# Altium schematic sheet Mainboard_RMII_Interface.SchDoc
size A4
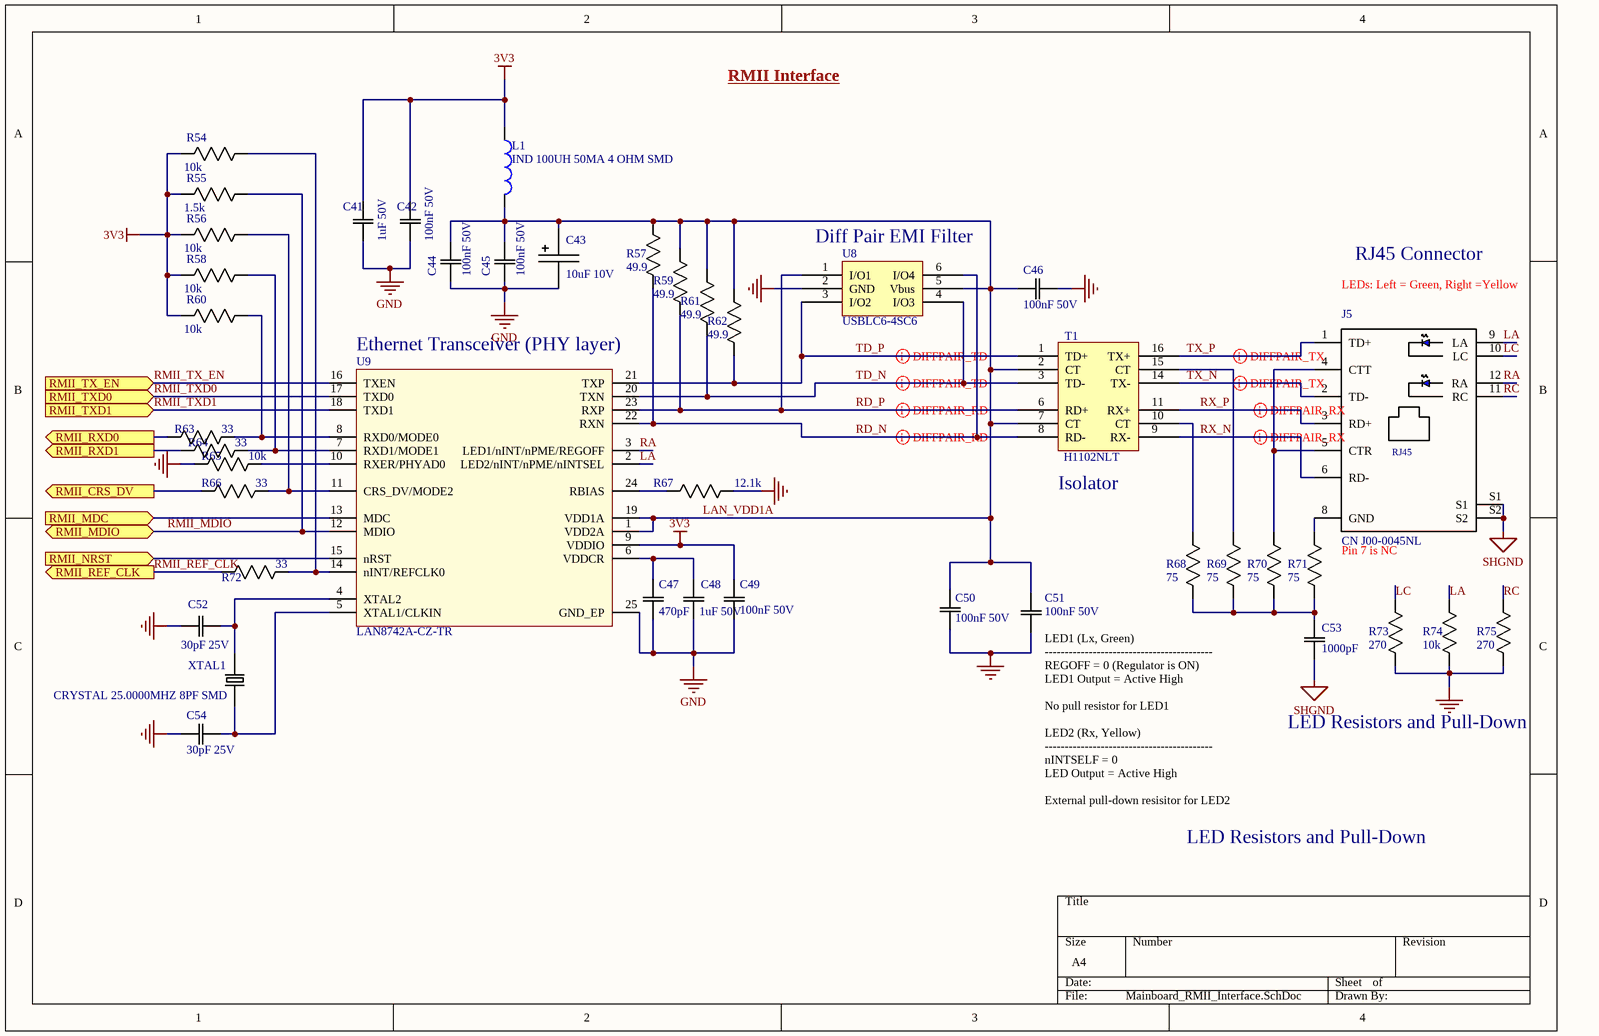
[diagram p0: Mainboard_RMII_Interface.SchDoc]

## Parts
C41  1uF 50V  [0805]
C42  100nF 50V  [0805]
C43  10uF 10V  [1206 Polarized]
C44  100nF 50V  [0805]
C45  100nF 50V  [0805]
C46  100nF 50V  [0805]
C47  470pF  [0805]
C48  1uF 50V  [0805]
C49  100nF 50V  [0805]
C50  100nF 50V  [0805]
C51  100nF 50V  [0805]
C52  30pF 25V  [0805]
C53  1000pF  [0805]
C54  30pF 25V  [0805]
J5  CN J00-0045NL  [RJ45 J00-0045NL]
L1  IND 100UH 50MA 4 OHM SMD  [0805]
R54  10k  [0805]
R55  1.5k  [0805]
R56  10k  [0805]
R57  49.9  [0805]
R58  10k  [0805]
R59  49.9  [0805]
R60  10k  [0805]
R61  49.9  [0805]
R62  49.9  [0805]
R63  33  [0805]
R64  33  [0805]
R65  10k  [0805]
R66  33  [0805]
R67  12.1k  [0805]
R68  75  [0805]
R69  75  [0805]
R70  75  [0805]
R71  75  [0805]
R72  33  [0805]
R73  270  [0805]
R74  10k  [0805]
R75  270  [0805]
T1  H1102NLT  [TRANSFORMER]
U8  USBLC6-4SC6  [SOT23-6L]
U9  LAN8742A-CZ-TR  [24-QFN (4x4)]
XTAL1  CRYSTAL 25.0000MHZ 8PF SMD  [SMD-2]

## Ports
RMII_CRS_DV (out), RMII_MDC (in), RMII_MDIO (bidir), RMII_NRST (in), RMII_REF_CLK (out), RMII_RXD0 (out), RMII_RXD1 (out), RMII_TX_EN (in), RMII_TXD0 (in), RMII_TXD1 (in)

## Nets
3V3: C41.2(C2) C42.2(C2) C49.2(C2) L1.1 R54.2(R2) R55.2(R2) R56.2(R2) R58.2(R2) R60.2(R2) U9.9(VDDIO)
GND: C41.1(C1) C42.1(C1) C43.2(P$2) C44.1(C1) C45.1(C1) C46.2(C2) C47.1(C1) C48.1(C1) C49.1(C1) C50.1(C1) C51.1(C1) C52.1(C1) C54.1(C1) R65.2(R2) R67.1(R1) R73.2(R2) R74.2(R2) R75.2(R2) U8.2(GND) U9.25(GND_EP)
SHGND: C53.1(C1) J5.S1 J5.S2
LA: J5.9(LA) R74.1(R1) U9.2(LED2/nINT/nPME/nINTSEL)
LAN_VDD1A: C43.1(P$1) C44.2(C2) C45.2(C2) C46.1(C1) C50.2(C2) C51.2(C2) L1.2 R57.1(R1) R59.1(R1) R61.1(R1) R62.1(R1) T1.2(CT) T1.7(CT) U8.5(Vbus) U9.1(VDD2A) U9.19(VDD1A)
LC: J5.10(LC) R73.1(R1)
RA: J5.12(RA) U9.3(LED1/nINT/nPME/REGOFF)
RC: J5.11(RC) R75.1(R1)
RD_N: R57.2(R2) T1.8(RD-) U8.6(I/O4) U9.22(RXN)
RD_P: R59.2(R2) T1.6(RD+) U8.1(I/O1) U9.23(RXP)
RMII_CRS_DV: R66.2(R2) ; port RMII_CRS_DV
RMII_MDC: U9.13(MDC) ; port RMII_MDC
RMII_MDIO: R55.1(R1) U9.12(MDIO) ; port RMII_MDIO
RMII_NRST: U9.15(nRST) ; port RMII_NRST
RMII_REF_CLK: R72.2(R2) ; port RMII_REF_CLK
RMII_RXD0: R63.2(R2) ; port RMII_RXD0
RMII_RXD1: R64.2(R2) ; port RMII_RXD1
RMII_TX_EN: U9.16(TXEN) ; port RMII_TX_EN
RMII_TXD0: U9.17(TXD0) ; port RMII_TXD0
RMII_TXD1: U9.18(TXD1) ; port RMII_TXD1
RX_N: J5.6(RD-) T1.9(RX-)
RX_P: J5.3(RD+) T1.11(RX+)
TD_N: R61.2(R2) T1.3(TD-) U8.4(I/O3) U9.20(TXN)
TD_P: R62.2(R2) T1.1(TD+) U8.3(I/O2) U9.21(TXP)
TX_N: J5.2(TD-) T1.14(TX-)
TX_P: J5.1(TD+) T1.16(TX+)
NetC47_2: C47.2(C2) C48.2(C2) U9.6(VDDCR)
NetC52_2: C52.2(C2) U9.4(XTAL2) XTAL1.2
NetC53_2: C53.2(C2) R68.2(R2) R69.2(R2) R70.2(R2) R71.2(R2)
NetC54_2: C54.2(C2) U9.5(XTAL1/CLKIN) XTAL1.1
NetJ5_4: J5.4(CTT) J5.5(CTR) R70.1(R1)
NetJ5_8: J5.8(GND) R71.1(R1)
NetR54_1: R54.1(R1) R72.1(R1) U9.14(nINT/REFCLK0)
NetR56_1: R56.1(R1) R66.1(R1) U9.11(CRS_DV/MODE2)
NetR58_1: R58.1(R1) R64.1(R1) U9.7(RXD1/MODE1)
NetR60_1: R60.1(R1) R63.1(R1) U9.8(RXD0/MODE0)
NetR65_1: R65.1(R1) U9.10(RXER/PHYAD0)
NetR67_2: R67.2(R2) U9.24(RBIAS)
NetR68_1: R68.1(R1) T1.10(CT)
NetR69_1: R69.1(R1) T1.15(CT)

## Layout directives
differential pair: RD_N, RD_P, RX_N, RX_P, TD_N, TD_P, TX_N, TX_P

## Notes on the sheet
- RMII Interface
- (near U8) Diff Pair EMI Filter
- (near J5) LEDs: Left = Green, Right =Yellow
- RJ45 Connector
- Ethernet Transceiver (PHY layer)
- (near T1) Isolator
- Pin 7 is NC
- LED Resistors and Pull-Down
- (near C51) LED1 (Lx, Green)
  ------------------------------------------
  REGOFF = 0 (Regulator is ON)
  LED1 Output = Active High
  No pull resistor for LED1
  LED2 (Rx, Yellow)
  ------------------------------------------
  nINTSELF = 0
  LED Output = Active High
  External pull-down resisitor for LED2
- (in symbol CN MAGJACK) RJ45

## Library data of the parts
C41 C48 = CAP 1uF 50V: CAP CER 1UF 50V X7R 0805; Tolerance: 10%; Package: 0805; Value: 1uF; Rating: 50V; Temperature Coefficient: X7R; Operating Temperature: -55°C ~ 125°C
C42 C44-C46 C49-C51 = CAP 100nF 50V: CAP CER 0.1UF 50V X7R 0805; Tolerance: 10%; Package: 0805; Value: 100nF; Rating: 50V
C43 = CAP TANT 10uF 10V: CAP TANT 10UF 10V 1206; Tolerance: 10%; ESR (Equivalent Series Resistance): 3.8 Ohm; Type: Molded Tantalum; Package: 1206; Value: 10uF; Rating: 10V; Operating Temperature: -55°C ~ 125°C
C47 = CAP 470pF 50V: CAP CER 470PF 50V X7R 0603/0805; Tolerance: 10%; Package: 0603/0805; Value: 470pF; Rating: 50V; Temperature Coefficient: X7R; Operating Temperature: -55°C ~ 125°C
C52 C54 = CAP 30pF 25V: CAP CER 30PF 25V NP0 0805; Tolerance: 20%; Package: 0805; Value: 30pF; Rating: 25V
C53 = CAP 1000pF 50V: CAP CER 1000PF 50V X7R 0603/0805; Tolerance: 10%; Package: 0603/0805; Value: 1000pF; Rating: 50V; Temperature Coefficient: X7R; Operating Temperature: -55°C ~ 125°C
J5 = CN MAGJACK: CN MAGJACK 1PORT 100 BASE-TX; MF: Pulse Electronics; Package: None; SnapEDA_Link: https://www.snapeda.com/parts/J00-0045NL/Pulse%20Electronics%20Network/view-part/87956/?ref=snap; MP: J00-0045NL; Value: *; Digikey Link: https://www.digikey.com/product-detail/en/pulse-electronics-network/J00-0045NL/553-1619-5-ND/1036860?utm_source=snapeda&utm_medium=aggregator&utm_campaign=symbol; Digikey: 553-1619-5-ND; Supplier 1: Mouser; Supplier Part Number 1: 673-J00-0045NL
L1 = IND 100UH 50MA 4 OHM SMD: 100µH Unshielded Wirewound Inductor 50mA 4Ohm 0805 (2012 Metric); MF: Taiyo Yuden; MP: LBR2012T101K; Revision: July-2002: Re-released for DXP Platform.; Value: 100uH; Digikey: 587-2048-1-ND; Digikey Link: https://www.digikey.ca/product-detail/en/taiyo-yuden/LBR2012T101K/587-2048-1-ND/1788995; Supplier 1: Digi-Key; Supplier Part Number 1: 587-4040-1-ND
R54 R56 R58 R60 R65 R74 = RES 10k 1/8W - 1%: RES SMD 10K OHM 1% 1/8W 0805; Power (Watts): 0.125W; Package: 0805; Value: 10k; Tolerance: 1%
R55 = RES 1.5k 1/8W - 1%: RES SMD 1.5K OHM 1% 1/8W 0805; Power (Watts): 0.125W; Package: 0805; Value: 1.5k; Tolerance: 1%; ComponentLink1Description: digikey; ComponentLink1URL: https://www.digikey.ca/en/products/detail/panasonic-electronic-components/ERJ-6ENF1022V/111476
R57 R59 R61 R62 = RES 49.9 1/8W: RES SMD 49.9 OHM 1% 1/8W 0805; Power (Watts): 0.125W; Package: 0805; Value: 49.9; Tolerance: 1%
R63 R64 R66 R72 = RES 33.0 1/8W - 1%: RES SMD 33 OHM 1% 1/8W 0805; Power (Watts): 0.125W; Package: 0805; Value: 33; Tolerance: 1%
R67 = RES 12.1k 1/8W: RES SMD 12.1K OHM 1% 1/8W 0805; Power (Watts): 0.125W; Package: 0805; Value: 12.1k; Tolerance: 1%
R68-R71 = RES 75.0 1/8W - 1%: RES SMD 75 OHM 1% 1/8W 0805; Power (Watts): 0.125W; Package: 0805; Value: 75; Tolerance: 1%
R73 R75 = RES 270.0 1/8W: RES SMD 270 OHM 5% 1/8W 0805; Power (Watts): 0.125W; Package: 0805; Value: 270; Tolerance: 5%
T1 = XFRMR H1102NLT: Isolation and Data Interface (Encapsulated) Pulse Transformer 1:1 Transmitter, 1:1 Receiver Surface Mount; MF: Pulse Electronics; Package: SOIC-16; Price: 7.99 CAD; MP: H1102NL; Digikey: 553-1323-5-ND; Digikey Link: https://www.digikey.ca/en/products/detail/pulse-electronics-network/H1102NL/1036940?s=N4IgTCBcDaIBIEYEAYwDkAyIC6BfIA; Supplier 1: Digi-Key; Supplier Part Number 1: 553-1323-5-ND
U9 = LAN8742A-CZ-TR: LAN8742A-CZ-TR - Small Footprint RMII 10/100 Ethernet, Transceiver with HP Auto-MDIX and flexPWR Technology SQFN-24; MF: Microchip Technology; MP: LAN8742A-CZ-TR; Digikey: LAN8742A-CZ-CT-ND; Digikey Link: https://www.digikey.ca/product-detail/en/microchip-technology/LAN8742A-CZ-TR/LAN8742A-CZ-CT-ND/8256089; Supplier 1: Digi-Key; Supplier Part Number 1: LAN8742A-CZ-CT-ND
XTAL1 = XTAL 25MHZ 8PF SMD: 25MHz ±50ppm Crystal 8pF 70 Ohms 2-SMD, No Lead; MP: NX5032GA-25.000000MHZ-LN-CD-1; MF: NDK America, Inc.; ESR: 70 Ohms; Package: 2-SMD, No Lead; Price: 0.95 CAD; Frequency: 25MHz; Digikey: 644-1041-1-ND; Digikey Link: https://www.digikey.ca/product-detail/en/ndk-america-inc/NX5032GA-25.000000MHZ-LN-CD-1/644-1041-1-ND/1128913; Load Capacitance: 8pF; Supplier 1: Digi-Key; Supplier Part Number 1: 644-1041-1-ND